# Altium schematic sheet ina219.SchDoc
size A2
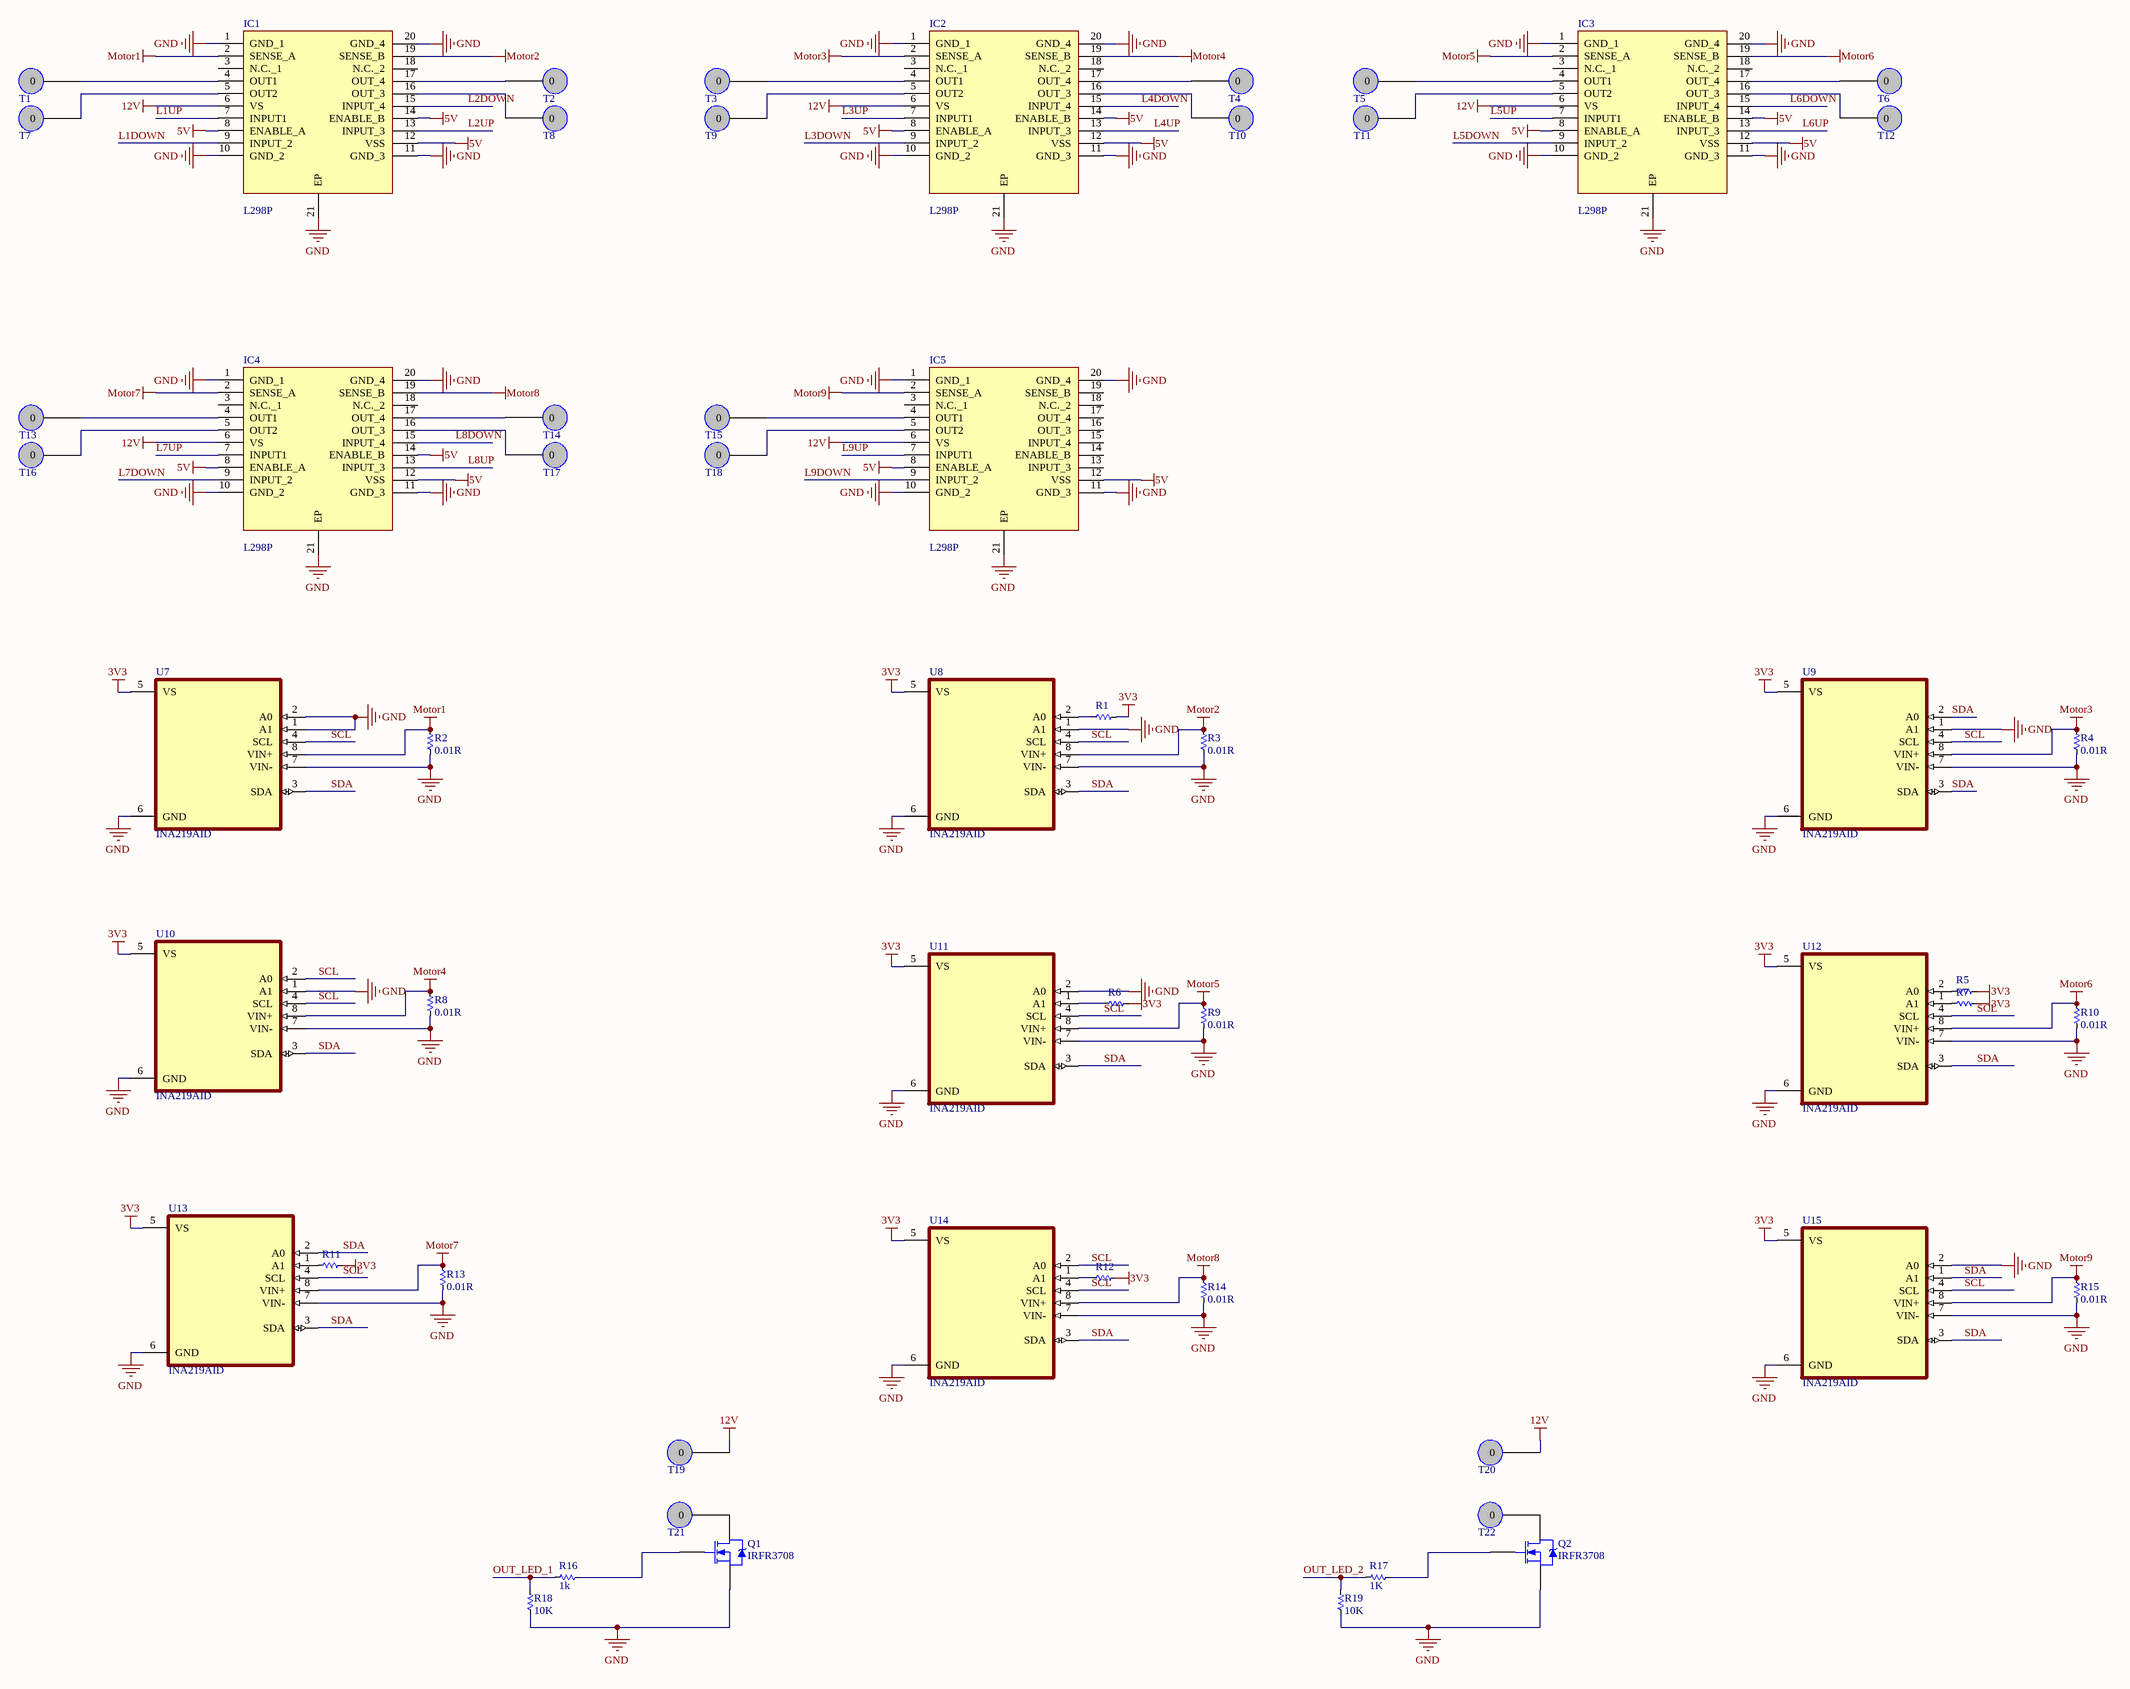
[diagram p0: ina219.SchDoc]

## Parts
IC1  L298P  [SOIC127P1420X360-21N]
IC2  L298P  [SOIC127P1420X360-21N]
IC3  L298P  [SOIC127P1420X360-21N]
IC4  L298P  [SOIC127P1420X360-21N]
IC5  L298P  [SOIC127P1420X360-21N]
Q1  IRFR3708  [TO-252AA_M]
Q2  IRFR3708  [TO-252AA_M]
R1  Res  [RES-SMD-0603]  (value not drawn)
R2  0.01R  [RES-SMD-2512]
R3  0.01R  [RES-SMD-2512]
R4  0.01R  [RES-SMD-2512]
R5  Res  [RES-SMD-0603]  (value not drawn)
R6  Res  [RES-SMD-0603]  (value not drawn)
R7  Res  [RES-SMD-0603]  (value not drawn)
R8  0.01R  [RES-SMD-2512]
R9  0.01R  [RES-SMD-2512]
R10  0.01R  [RES-SMD-2512]
R11  Res  [RES-SMD-0603]  (value not drawn)
R12  Res  [RES-SMD-0603]  (value not drawn)
R13  0.01R  [RES-SMD-2512]
R14  0.01R  [RES-SMD-2512]
R15  0.01R  [RES-SMD-2512]
R16  1k  [RES-SMD-0603]
R17  1K  [RES-SMD-0603]
R18  10K  [RES-SMD-0603]
R19  10K  [RES-SMD-0603]
T1  Pad  [PCBComponent_1]  (value not drawn)
T2  Pad  [PCBComponent_1]  (value not drawn)
T3  Pad  [PCBComponent_1]  (value not drawn)
T4  Pad  [PCBComponent_1]  (value not drawn)
T5  Pad  [PCBComponent_1]  (value not drawn)
T6  Pad  [PCBComponent_1]  (value not drawn)
T7  Pad  [PCBComponent_1]  (value not drawn)
T8  Pad  [PCBComponent_1]  (value not drawn)
T9  Pad  [PCBComponent_1]  (value not drawn)
T10  Pad  [PCBComponent_1]  (value not drawn)
T11  Pad  [PCBComponent_1]  (value not drawn)
T12  Pad  [PCBComponent_1]  (value not drawn)
T13  Pad  [PCBComponent_1]  (value not drawn)
T14  Pad  [PCBComponent_1]  (value not drawn)
T15  Pad  [PCBComponent_1]  (value not drawn)
T16  Pad  [PCBComponent_1]  (value not drawn)
T17  Pad  [PCBComponent_1]  (value not drawn)
T18  Pad  [PCBComponent_1]  (value not drawn)
T19  Pad  [PCBComponent_1]  (value not drawn)
T20  Pad  [PCBComponent_1]  (value not drawn)
T21  Pad  [PCBComponent_1]  (value not drawn)
T22  Pad  [PCBComponent_1]  (value not drawn)
U7  INA219AID  [SOIC127P599X175-8N]
U8  INA219AID  [SOIC127P599X175-8N]
U9  INA219AID  [SOIC127P599X175-8N]
U10  INA219AID  [SOIC127P599X175-8N]
U11  INA219AID  [SOIC127P599X175-8N]
U12  INA219AID  [SOIC127P599X175-8N]
U13  INA219AID  [SOIC127P599X175-8N]
U14  INA219AID  [SOIC127P599X175-8N]
U15  INA219AID  [SOIC127P599X175-8N]

## Nets
3V3: R1.1 R5.1 R6.1 R7.1 R11.1 R12.1 U7.5(VS) U8.5(VS) U9.5(VS) U10.5(VS) U11.5(VS) U12.5(VS) U13.5(VS) U14.5(VS) U15.5(VS)
5V: IC1.8(ENABLE_A) IC1.12(VSS) IC1.14(ENABLE_B) IC2.8(ENABLE_A) IC2.12(VSS) IC2.14(ENABLE_B) IC3.8(ENABLE_A) IC3.12(VSS) IC3.14(ENABLE_B) IC4.8(ENABLE_A) IC4.12(VSS) IC4.14(ENABLE_B) IC5.8(ENABLE_A) IC5.12(VSS)
12V: IC1.6(VS) IC2.6(VS) IC3.6(VS) IC4.6(VS) IC5.6(VS) T19.0 T20.0
GND: IC1.1(GND_1) IC1.10(GND_2) IC1.11(GND_3) IC1.20(GND_4) IC1.21(EP) IC2.1(GND_1) IC2.10(GND_2) IC2.11(GND_3) IC2.20(GND_4) IC2.21(EP) IC3.1(GND_1) IC3.10(GND_2) IC3.11(GND_3) IC3.20(GND_4) IC3.21(EP) IC4.1(GND_1) IC4.10(GND_2) IC4.11(GND_3) IC4.20(GND_4) IC4.21(EP) IC5.1(GND_1) IC5.10(GND_2) IC5.11(GND_3) IC5.20(GND_4) IC5.21(EP) Q1.3(S) Q2.3(S) R2.2 R3.2 R4.2 R8.2 R9.2 R10.2 R13.2 R14.2 R15.2 R18.2 R19.2 U7.1(A1) U7.2(A0) U7.6(GND) U7.7(VIN-) U8.1(A1) U8.6(GND) U8.7(VIN-) U9.1(A1) U9.6(GND) U9.7(VIN-) U10.1(A1) U10.6(GND) U10.7(VIN-) U11.2(A0) U11.6(GND) U11.7(VIN-) U12.6(GND) U12.7(VIN-) U13.6(GND) U13.7(VIN-) U14.6(GND) U14.7(VIN-) U15.2(A0) U15.6(GND) U15.7(VIN-)
Motor1: IC1.2(SENSE_A) R2.1 U7.8(VIN+)
Motor2: IC1.19(SENSE_B) R3.1 U8.8(VIN+)
Motor3: IC2.2(SENSE_A) R4.1 U9.8(VIN+)
Motor4: IC2.19(SENSE_B) R8.1 U10.8(VIN+)
Motor5: IC3.2(SENSE_A) R9.1 U11.8(VIN+)
Motor6: IC3.19(SENSE_B) R10.1 U12.8(VIN+)
Motor7: IC4.2(SENSE_A) R13.1 U13.8(VIN+)
Motor8: IC4.19(SENSE_B) R14.1 U14.8(VIN+)
Motor9: IC5.2(SENSE_A) R15.1 U15.8(VIN+)
L1DOWN: IC1.9(INPUT_2)
L1UP: IC1.7(INPUT1)
L2DOWN: IC1.15(INPUT_4)
L2UP: IC1.13(INPUT_3)
L3DOWN: IC2.9(INPUT_2)
L3UP: IC2.7(INPUT1)
L4DOWN: IC2.15(INPUT_4)
L4UP: IC2.13(INPUT_3)
L5DOWN: IC3.9(INPUT_2)
L5UP: IC3.7(INPUT1)
L6DOWN: IC3.15(INPUT_4)
L6UP: IC3.13(INPUT_3)
L7DOWN: IC4.9(INPUT_2)
L7UP: IC4.7(INPUT1)
L8DOWN: IC4.15(INPUT_4)
L8UP: IC4.13(INPUT_3)
L9DOWN: IC5.9(INPUT_2)
L9UP: IC5.7(INPUT1)
OUT_LED_1: R16.1 R18.1
OUT_LED_2: R17.1 R19.1
SCL: U7.4(SCL) U8.4(SCL) U9.4(SCL) U10.2(A0) U10.4(SCL) U11.4(SCL) U12.4(SCL) U13.4(SCL) U14.2(A0) U14.4(SCL) U15.4(SCL)
SDA: U7.3(SDA) U8.3(SDA) U9.2(A0) U9.3(SDA) U10.3(SDA) U11.3(SDA) U12.3(SDA) U13.2(A0) U13.3(SDA) U14.3(SDA) U15.1(A1) U15.3(SDA)
NetIC1_4: IC1.4(OUT1) T1.0
NetIC1_5: IC1.5(OUT2) T7.0
NetIC1_16: IC1.16(OUT_3) T8.0
NetIC1_17: IC1.17(OUT_4) T2.0
NetIC2_4: IC2.4(OUT1) T3.0
NetIC2_5: IC2.5(OUT2) T9.0
NetIC2_16: IC2.16(OUT_3) T10.0
NetIC2_17: IC2.17(OUT_4) T4.0
NetIC3_4: IC3.4(OUT1) T5.0
NetIC3_5: IC3.5(OUT2) T11.0
NetIC3_16: IC3.16(OUT_3) T12.0
NetIC3_17: IC3.17(OUT_4) T6.0
NetIC4_4: IC4.4(OUT1) T13.0
NetIC4_5: IC4.5(OUT2) T16.0
NetIC4_16: IC4.16(OUT_3) T17.0
NetIC4_17: IC4.17(OUT_4) T14.0
NetIC5_4: IC5.4(OUT1) T15.0
NetIC5_5: IC5.5(OUT2) T18.0
NetQ1_1: Q1.1(G) R16.2
NetQ1_4: Q1.4(D) T21.0
NetQ2_1: Q2.1(G) R17.2
NetQ2_4: Q2.4(D) T22.0
NetR1_2: R1.2 U8.2(A0)
NetR5_2: R5.2 U12.2(A0)
NetR6_2: R6.2 U11.1(A1)
NetR7_2: R7.2 U12.1(A1)
NetR11_2: R11.2 U13.1(A1)
NetR12_2: R12.2 U14.1(A1)

Not connected (* = marked no-connect by the designer): IC1 3(N.C._1) 18(N.C._2); IC2 3(N.C._1) 18(N.C._2); IC3 3(N.C._1) 18(N.C._2); IC4 3(N.C._1) 18(N.C._2); IC5 3(N.C._1) 13(INPUT_3) 14(ENABLE_B) 15(INPUT_4) 16(OUT_3) 17(OUT_4) 18(N.C._2) 19(SENSE_B)

## Library data of the parts
IC1-IC5 = L298P: Integrated Circuit; Manufacturer_Name: STMicroelectronics; Datasheet Link: https://datasheet.datasheetarchive.com/originals/distributors/Datasheets-32/DSA-634400.pdf; Height: 3.6mm; Manufacturer_Part_Number: L298P; Mouser Part Number: 511-L298P; Mouser Price/Stock: https://www.mouser.co.uk/ProductDetail/STMicroelectronics/L298P?qs=lDh9v96ogBZNJERYYNX11w%3D%3D; Arrow Part Number: L298P; Arrow Price/Stock: https://www.arrow.com/en/products/l298p/stmicroelectronics
Q1 Q2 = IRFR3910: HEXFET Power MOSFET; Note: Pin 2 is trimmed and is electrically connected to Drain.; Published: 8-Jun-2000; LatestRevisionDate: 20-Nov-2009; LatestRevisionNote: IPC-7351 Footprint Added.; DatasheetVersion: May-1998; PackageVersion: Feb-2003; PackageReference: TO-252AA; Publisher: Altium Limited; PackageDescription: 3-Pin HEXFET Package 2.28 mm Pitch, 9.9 mm Lead Span; Code_JEDEC: TO-252-AA; ComponentLink1Description: Manufacturer Link; ComponentLink1URL: http://www.irf.com/; ComponentLink2Description: Datasheet; ComponentLink2URL: http://www.irf.com/product-info/datasheets/data/irfr3910.pdf
R1-R19 = Res-SMD: Resistor; Manufacturer: Generic Components; Class: Passive; Published: 08/06/2000; Publisher: Altium Hobart Technology Centre
T1-T22 = Component_1
U7-U15 = INA219AID: 26V, 12-bit, i2c output current/voltage/power monitor 8-SOIC -40 to 125; MF: Texas Instruments; Purchase-URL: https://pricing.snapeda.com/search/part/INA219AID/?ref=eda; Package: SOIC-8 Texas Instruments; SnapEDA_Link: https://www.snapeda.com/parts/INA219AID/Texas%20Instruments/view-part/522322/?ref=snap; Value: *; Price: None; MP: INA219AID; Availability: Warning; Check_prices: https://www.snapeda.com/parts/INA219AID/Texas%20Instruments/view-part/522322/?ref=eda